# EAGLE schematic prod (EAGLE 8.7.1)
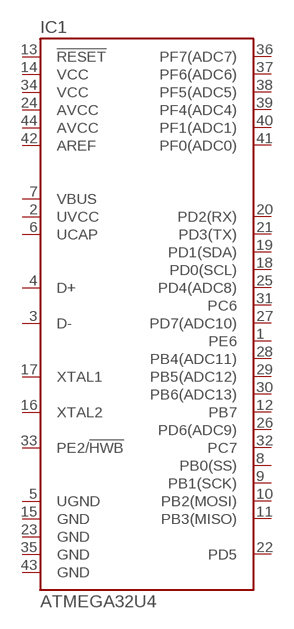
[diagram p0: schematic, sheet 1]

## Parts
IC1  ATMEGA32U4  [QFP80P1200X1225X120-44]
Unconnected: IC1.1(PE6) IC1.3(D-) IC1.4(D+) IC1.7(VBUS) IC1.8(PB0(SS)) IC1.9(PB1(SCK)) IC1.10(PB2(MOSI)) IC1.11(PB3(MISO)) IC1.12(PB7) IC1.13(!RESET) IC1.16(XTAL2) IC1.17(XTAL1) IC1.18(PD0(SCL)) IC1.19(PD1(SDA)) IC1.20(PD2(RX)) IC1.21(PD3(TX)) IC1.22(PD5) IC1.25(PD4(ADC8)) IC1.26(PD6(ADC9)) IC1.27(PD7(ADC10)) IC1.28(PB4(ADC11)) IC1.29(PB5(ADC12)) IC1.30(PB6(ADC13)) IC1.31(PC6) IC1.32(PC7) IC1.33(PE2/!HWB) IC1.36(PF7(ADC7)) IC1.37(PF6(ADC6)) IC1.38(PF5(ADC5)) IC1.39(PF4(ADC4)) IC1.40(PF1(ADC1)) IC1.41(PF0(ADC0)) IC1.42(AREF)

## Power pins joined to a net without a drawn wire
AVCC: IC1.24(AVCC) IC1.44(AVCC)
GND: IC1.15(GND) IC1.23(GND) IC1.35(GND) IC1.43(GND)
UCAP: IC1.6(UCAP)
UGND: IC1.5(UGND)
UVCC: IC1.2(UVCC)
VCC: IC1.14(VCC) IC1.34(VCC)

## Library data of the parts
IC1 = ICs:ATMEGA32U4